# Altium schematic sheet schematic.schdoc
size 146 x 98 mm
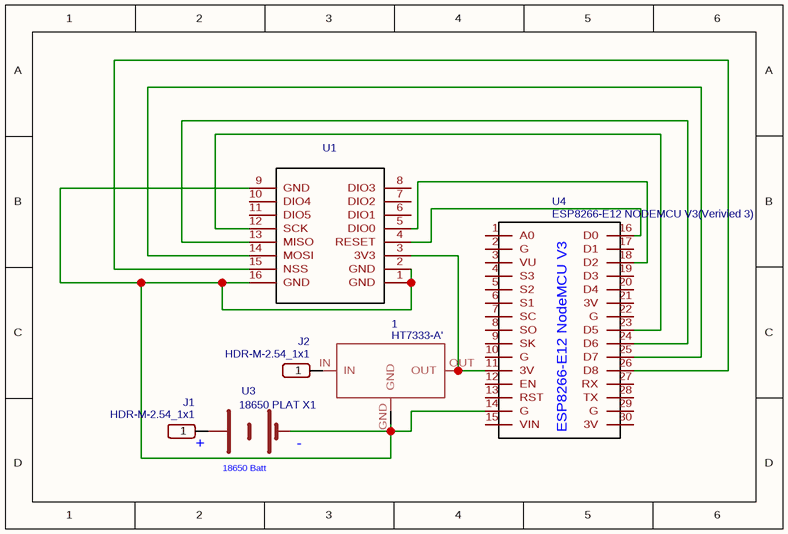
[diagram p0: schematic.schdoc]

## Parts
1  HT7333-A'  [TO92]
J1  HDR-M-2.54_1x1  [HDR-M-2.54_1X1]
J2  HDR-M-2.54_1x1  [HDR-M-2.54_1X1]
U1  NO  [LORA SX1278 RA-02 WIRELESS MODULE]  (value not drawn)
U3  18650 PLAT X1  [ADAFRUIT 18650 BATTERY HOLDER KFLMIAMI420 BH-18650-PC-ND]
U4  ESP8266-E12 NODEMCU V3(Verivied 3)  [ESP8266-E12-NODEMCU-V3]

## Nets
Net1_GND: 1.GND U1.1(GND) U1.2(GND) U1.9(GND) U1.16(GND) U3.2(-) U4.14(G)
Net1_IN: 1.IN J2.1
Net1_OUT: 1.OUT U1.3(3V3) U4.11(3V)
NetJ1_1: J1.1 U3.1(+)
NetU1_4: U1.4(RESET) U4.16(D0)
NetU1_5: U1.5(DIO0) U4.18(D2)
NetU1_12: U1.12(SCK) U4.23(D5)
NetU1_13: U1.13(MISO) U4.24(D6)
NetU1_14: U1.14(MOSI) U4.25(D7)
NetU1_15: U1.15(NSS) U4.26(D8)

Not connected (* = marked no-connect by the designer): U1 6(DIO1) 7(DIO2) 8(DIO3) 10(DIO4) 11(DIO5); U4 1(A0) 2(G) 3(VU) 4(S3) 5(S2) 6(S1) 7(SC) 8(SO) 9(SK) 10(G) 12(EN) 13(RST) 15(VIN) 17(D1) 19(D3) 20(D4) 21(3V) 22(G) 27(RX) 28(TX) 29(G) 30(3V)

## Notes on the sheet
- (in symbol 18650 PLAT X1) 18650 Batt
- (in symbol ESP8266-E12 NODEMCU V3(Verivied 3)) ESP8266-E12 NodeMCU V3

## Library data of the parts
1 = HT7333-A': Contributor: userweb; spicePre: ?; spiceSymbolName: HT7333-A'
J1 J2 = HDR-M-2.54_1x1: Contributor: LCEDA_Lib; Supplier Part: C81276; Supplier: LCSC; spicePre: J; spiceSymbolName: HDR-M-2.54_1x1
U1 = NO: Contributor: nuttphong.sa; spicePre: M; spiceSymbolName: LORA SX1278 RA-02
U3 = 18650 PLAT X1: Contributor: Andre C; link: BH-18650-PC-ND; spicePre: U; spiceSymbolName: 18650 PLAT X1
U4 = ESP8266-E12 NODEMCU V3(Verivied 3): Contributor: affanvb6; spicePre: U; spiceSymbolName: ESP8266-E12 NODEMCU V3(Verivied 3)